# Altium schematic sheet BLE主控原理图.SchDoc
size A4
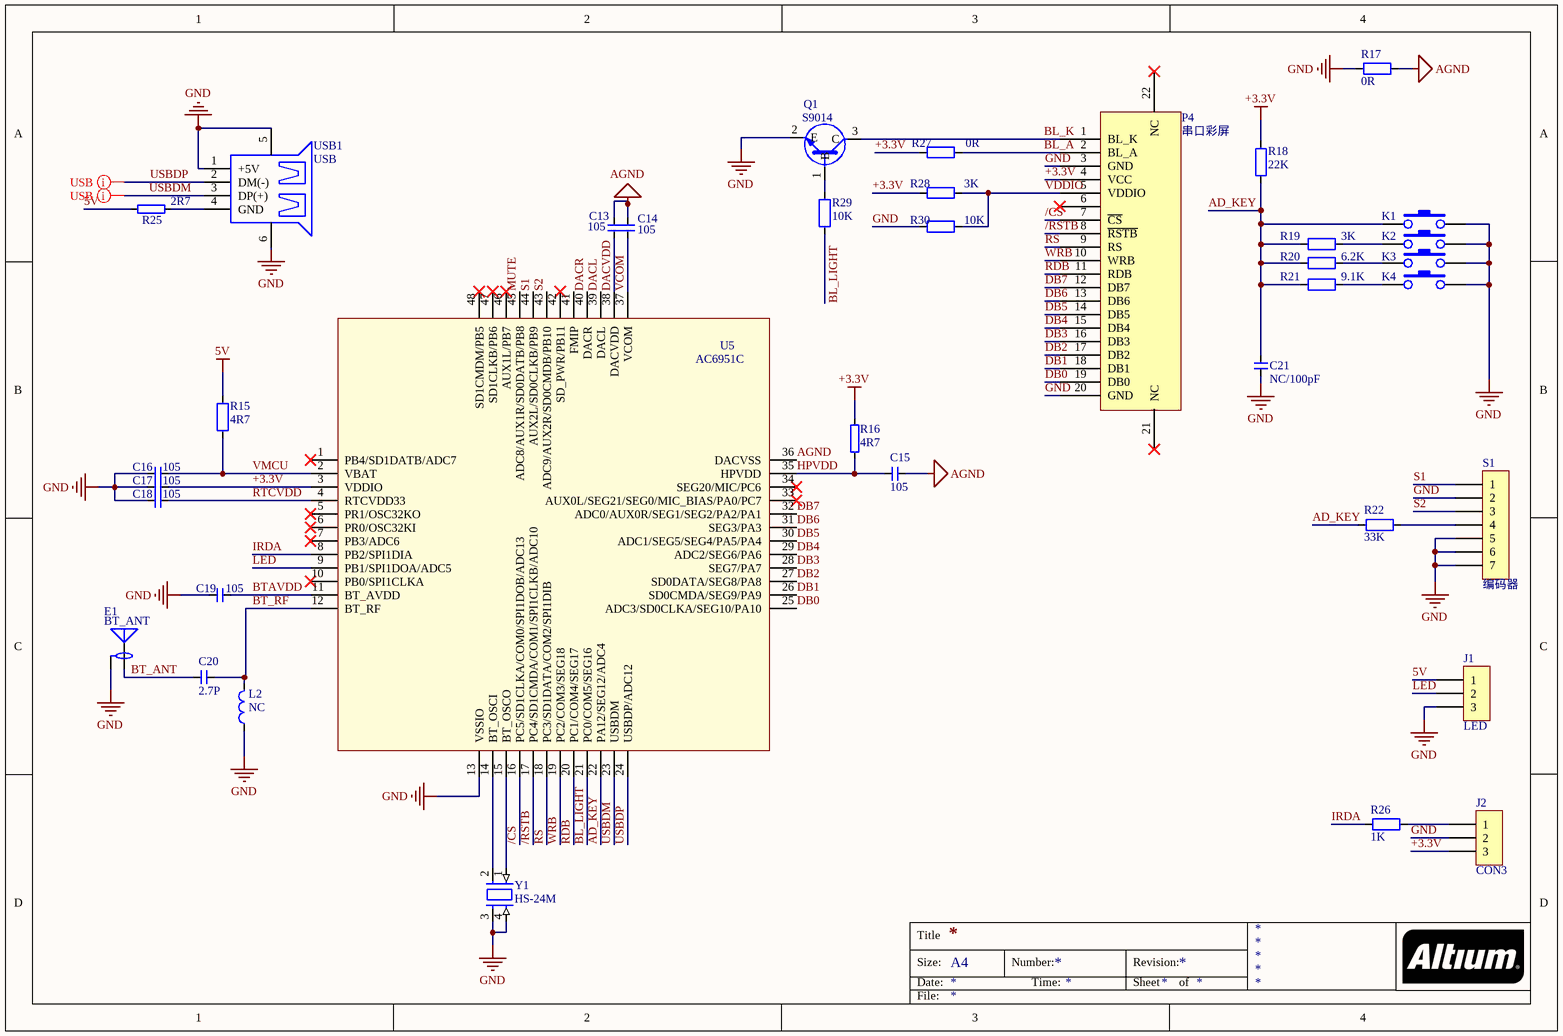
[diagram p0: BLE主控原理图.SchDoc]

## Parts
C13  105  [C0603]
C14  105  [C0603]
C15  105  [C0603]
C16  105  [C0603]
C17  105  [C0603]
C18  105  [C0603]
C19  105  [C0603]
C20  2.7P  [C0603]
C21  NC/100pF  [C0603]
E1  BT_ANT  [新F天线]
J1  LED  [CON-3X2.54]
J2  CON3  [CON-3X2.54]
K1  (no value)  [KEY]
K2  (no value)  [KEY]
K3  (no value)  [KEY]
K4  (no value)  [KEY]
L2  NC  [L0603]
P4  串口彩屏  [FFC-P20-1MM]
Q1  S9014  [SOT23]
R15  4R7  [R0805]
R16  4R7  [R0603]
R17  0R  [R0603]
R18  22K  [R0603]
R19  3K  [R0603]
R20  6.2K  [R0603]
R21  9.1K  [R0603]
R22  33K  [R0603]
R25  2R7  [R0603]
R26  1K  [R0603]
R27  0R  [R0603]
R28  3K  [R0603]
R29  10K  [R0603]
R30  10K  [R0603]
S1  编码器  [BMQ+PUSH]
U5  AC6951C  [LQFP48]
USB1  USB  [USBSMT]
Y1  HS-24M  [JZ]

## Nets
5V: J1.1 R15.1 R25.1
+3.3V: C17.2 J2.3 P4.4(VCC) R16.2 R18.2 R27.1 R28.2 U5.3(VDDIO)
AGND: C13.2 C14.2 C15.1 R17.2 U5.36(DACVSS)
GND: C16.1 C17.1 C18.1 C19.1 C21.2 E1.2 J1.3 J2.2 K1.2 K2.2 K3.2 K4.2 L2.1 P4.3(GND) P4.20(GND) Q1.2(E) R17.1 R30.2 S1.2 S1.5 S1.6 S1.7 U5.13(VSSIO) USB1.1(+5V) USB1.5 USB1.6 Y1.3 Y1.4
/CS: P4.7(~{CS}) U5.16(PC5/SD1CLKA/COM0/SPI1DOB/ADC13)
/RSTB: P4.8(~{RSTB}) U5.17(PC4/SD1CMDA/COM1/SPI1CLKB/ADC10)
AD_KEY: C21.1 K1.1 R18.1 R19.1 R20.1 R21.1 R22.1 U5.22(PA12/SEG12/ADC4)
BL_A: P4.2(BL_A) R27.2
BL_K: P4.1(BL_K) Q1.3(C)
BL_LIGHT: R29.1 U5.21(PC0/COM5/SEG16)
BT_ANT: C20.1 E1.1
BT_RF: C20.2 L2.2 U5.12(BT_RF)
BTAVDD: C19.2 U5.11(BT_AVDD)
DACL: U5.39(DACL)
DACR: U5.40(DACR)
DACVDD: C13.1 U5.38(DACVDD)
DB0: P4.19(DB0) U5.25(ADC3/SD0CLKA/SEG10/PA10)
DB1: P4.18(DB1) U5.26(SD0CMDA/SEG9/PA9)
DB2: P4.17(DB2) U5.27(SD0DATA/SEG8/PA8)
DB3: P4.16(DB3) U5.28(SEG7/PA7)
DB4: P4.15(DB4) U5.29(ADC2/SEG6/PA6)
DB5: P4.14(DB5) U5.30(ADC1/SEG5/SEG4/PA5/PA4)
DB6: P4.13(DB6) U5.31(SEG3/PA3)
DB7: P4.12(DB7) U5.32(ADC0/AUX0R/SEG1/SEG2/PA2/PA1)
HPVDD: C15.2 R16.1 U5.35(HPVDD)
IRDA: R26.1 U5.8(PB2/SPI1DIA)
LED: J1.2 U5.9(PB1/SPI1DOA/ADC5)
MUTE: U5.45(ADC8/AUX1R/SD0DATB/PB8)
RDB: P4.11(RDB) U5.20(PC1/COM4/SEG17)
RS: P4.9(RS) U5.18(PC3/SD1DATA/COM2/SPI1DIB)
RTCVDD: C18.2 U5.4(RTCVDD33)
S1: S1.1 U5.44(AUX2L/SD0CLKB/PB9)
S2: S1.3 U5.43(ADC9/AUX2R/SD0CMDB/PB10)
USBDM: U5.23(USBDM) USB1.3(DP(+))
USBDP: U5.24(USBDP/ADC12) USB1.2(DM(-))
VCOM: C14.1 U5.37(VCOM)
VDDIO: P4.5(VDDIO) R28.1 R30.1
VMCU: C16.2 R15.2 U5.2(VBAT)
WRB: P4.10(WRB) U5.19(PC2/COM3/SEG18)
NetJ2_1: J2.1 R26.2
NetK2_1: K2.1 R19.2
NetK3_1: K3.1 R20.2
NetK4_1: K4.1 R21.2
NetQ1_1: Q1.1(B) R29.2
NetR22_2: R22.2 S1.4
NetR25_2: R25.2 USB1.4(GND)
NetU5_14: U5.14(BT_OSCI) Y1.2
NetU5_15: U5.15(BT_OSCO) Y1.1

Not connected (* = marked no-connect by the designer): P4 6* 21(NC)* 22(NC)*; U5 1(PB4/SD1DATB/ADC7)* 5(PR1/OSC32KO)* 6(PR0/OSC32KI)* 7(PB3/ADC6)* 10(PB0/SPI1CLKA)* 33(AUX0L/SEG21/SEG0/MIC_BIAS/PA0/PC7)* 34(SEG20/MIC/PC6)* 41(FMIP) 42(SD_PWR/PB11)* 46(AUX1L/PB7)* 47(SD1CLKB/PB6)* 48(SD1CMDM/PB5)*

## Layout directives
USBDP: True: USBDP
USBDM: True: USBDM

## Notes on the sheet
- Title
- Size:
- Date:
- A4
- Number:
- Time:
- Revision:
- Sheet
- of
- File:

## Library data of the parts
C13-C21 = CAP-0603
J1 J2 = CON3: Connector
K1-K4 = Key
L2 = L
P4 = LCD-20P
Q1 = NPN
R15 R17-R22 R26-R30 = RES-0603
R16 R25 = RES
S1 = CON7: Connector
Y1 = CRYSTAL